# EAGLE design ft2232h-breakout-with-ground-planesch (EAGLE 9.3.0)

## Sheet 1 of 2
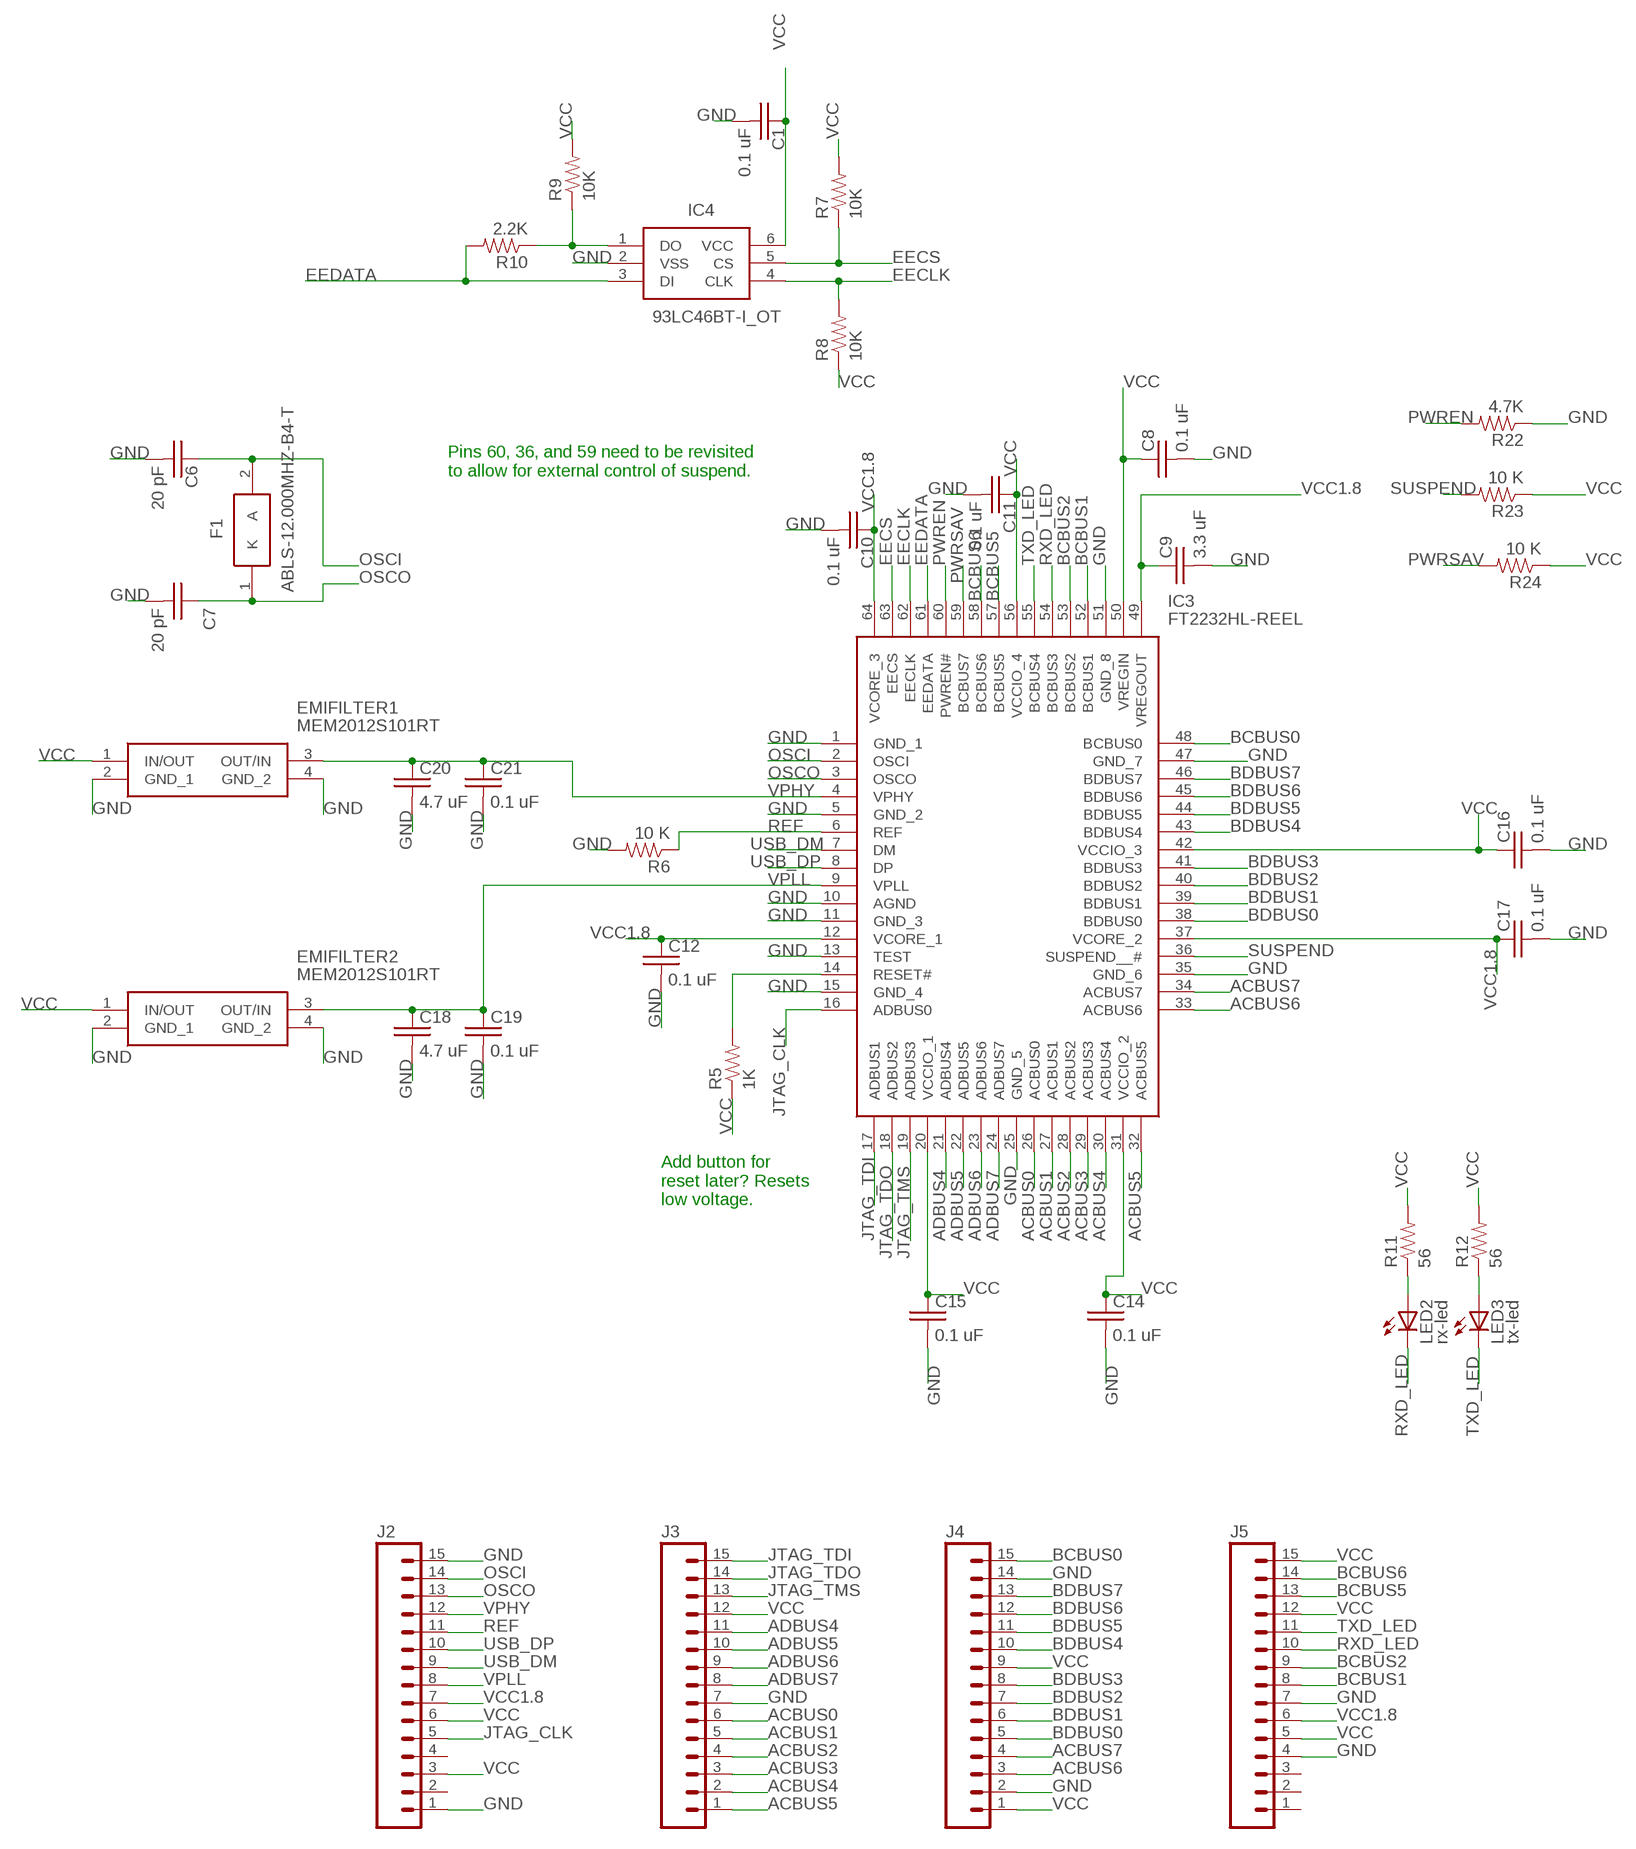
[diagram p0: schematic, sheet 1]

### Parts
C1  0.1 uF  C-USC0805  [C0805]
C6  20 pF  C-USC0805  [C0805]
C7  20 pF  C-USC0805  [C0805]
C8  0.1 uF  C-USC0805  [C0805]
C9  3.3 uF  C-USC0805  [C0805]
C10  0.1 uF  C-USC0805  [C0805]
C11  0.1 uF  C-USC0805  [C0805]
C12  0.1 uF  C-USC0805  [C0805]
C14  0.1 uF  C-USC0805  [C0805]
C15  0.1 uF  C-USC0805  [C0805]
C16  0.1 uF  C-USC0805  [C0805]
C17  0.1 uF  C-USC0805  [C0805]
C18  4.7 uF  C-USC0805  [C0805]
C19  0.1 uF  C-USC0805  [C0805]
C20  4.7 uF  C-USC0805  [C0805]
C21  0.1 uF  C-USC0805  [C0805]
EMIFILTER1  MEM2012S101RT  [MEM2012S101RT]
EMIFILTER2  MEM2012S101RT  [MEM2012S101RT]
F1  ABLS-12.000MHZ-B4-T  [HC/49US-(AT49)_1]
IC3  FT2232HL-REEL  [QFP50P1200X1200X160-64N]
IC4  93LC46BT-I_OT  [SOT95P270X145-6N]
J2  M15  [1X15]
J3  M15  [1X15]
J4  M15  [1X15]
J5  M15  [1X15]
LED2  rx-led  LED3MM  [LED3MM]
LED3  tx-led  LED3MM  [LED3MM]
R5  1K  RESISTOR0805-RES  [0805]
R6  10 K  RESISTOR0805-RES  [0805]
R7  10K  RESISTOR0805-RES  [0805]
R8  10K  RESISTOR0805-RES  [0805]
R9  10K  RESISTOR0805-RES  [0805]
R10  2.2K  RESISTOR0805-RES  [0805]
R11  56  RESISTOR0805-RES  [0805]
R12  56  RESISTOR0805-RES  [0805]
R22  4.7K  RESISTOR0805-RES  [0805]
R23  10 K  RESISTOR0805-RES  [0805]
R24  10 K  RESISTOR0805-RES  [0805]

### Nets
ACBUS0: IC3.26(ACBUS0) J3.6
ACBUS1: IC3.27(ACBUS1) J3.5
ACBUS2: IC3.28(ACBUS2) J3.4
ACBUS3: IC3.29(ACBUS3) J3.3
ACBUS4: IC3.30(ACBUS4) J3.2
ACBUS5: IC3.32(ACBUS5) J3.1
ACBUS6: IC3.33(ACBUS6) J4.3
ACBUS7: IC3.34(ACBUS7) J4.4
ADBUS4: IC3.21(ADBUS4) J3.11
ADBUS5: IC3.22(ADBUS5) J3.10
ADBUS6: IC3.23(ADBUS6) J3.9
ADBUS7: IC3.24(ADBUS7) J3.8
BCBUS0: IC3.48(BCBUS0) J4.15
BCBUS1: IC3.52(BCBUS1) J5.8
BCBUS2: IC3.53(BCBUS2) J5.9
BCBUS5: IC3.57(BCBUS5) J5.13
BCBUS6: IC3.58(BCBUS6) J5.14
BDBUS0: IC3.38(BDBUS0) J4.5
BDBUS1: IC3.39(BDBUS1) J4.6
BDBUS2: IC3.40(BDBUS2) J4.7
BDBUS3: IC3.41(BDBUS3) J4.8
BDBUS4: IC3.43(BDBUS4) J4.10
BDBUS5: IC3.44(BDBUS5) J4.11
BDBUS6: IC3.45(BDBUS6) J4.12
BDBUS7: IC3.46(BDBUS7) J4.13
EECLK: IC3.62(EECLK) IC4.4(CLK) R8.2
EECS: IC3.63(EECS) IC4.5(CS) R7.1
EEDATA: IC3.61(EEDATA) IC4.3(DI) R10.2
GND: C1.2 C6.2 C7.2 C8.2 C9.2 C10.2 C11.2 C12.2 C14.2 C15.2 C16.2 C17.2 C18.2 C19.2 C20.2 C21.2 EMIFILTER1.2(GND_1) EMIFILTER1.4(GND_2) EMIFILTER2.2(GND_1) EMIFILTER2.4(GND_2) IC3.1(GND_1) IC3.5(GND_2) IC3.10(AGND) IC3.11(GND_3) IC3.13(TEST) IC3.15(GND_4) IC3.25(GND_5) IC3.35(GND_6) IC3.47(GND_7) IC3.51(GND_8) IC4.2(VSS) J2.1 J2.15 J3.7 J4.2 J4.14 J5.4 J5.7 R6.2 R22.1 ; also sheet 2
JTAG_CLK: IC3.16(ADBUS0) J2.5
JTAG_TDI: IC3.17(ADBUS1) J3.15
JTAG_TDO: IC3.18(ADBUS2) J3.14
JTAG_TMS: IC3.19(ADBUS3) J3.13
N$6: IC3.14(RESET#) R5.2
N$8: IC4.1(DO) R9.1 R10.1
N$11: LED2.A R11.1
N$13: LED3.A R12.1
OSCI: C6.1 F1.2(A) IC3.2(OSCI) J2.14
OSCO: C7.1 F1.1(K) IC3.3(OSCO) J2.13
PWREN: IC3.60(PWREN#) R22.2
PWRSAV: IC3.59(BCBUS7) R24.2
REF: IC3.6(REF) J2.11 R6.1
RXD_LED: IC3.54(BCBUS3) J5.10 LED2.K(C)
SUSPEND: IC3.36(SUSPEND__#) R23.2
TXD_LED: IC3.55(BCBUS4) J5.11 LED3.K(C)
USB_DM: IC3.7(DM) J2.9 ; also sheet 2
USB_DP: IC3.8(DP) J2.10 ; also sheet 2
VCC [pwr]: C1.1 C8.1 C11.1 C14.1 C15.1 C16.1 EMIFILTER1.1(IN/OUT) EMIFILTER2.1(IN/OUT) IC3.20(VCCIO_1) IC3.31(VCCIO_2) IC3.42(VCCIO_3) IC3.50(VREGIN) IC3.56(VCCIO_4) IC4.6(VCC) J2.3 J2.6 J3.12 J4.1 J4.9 J5.5 J5.12 J5.15 R5.1 R7.2 R8.1 R9.2 R11.2 R12.2 R23.1 R24.1 ; also sheet 2
VCC1.8 [pwr]: C9.1 C10.1 C12.1 C17.1 IC3.12(VCORE_1) IC3.37(VCORE_2) IC3.49(VREGOUT) IC3.64(VCORE_3) J2.7 J5.6
VPHY: C20.1 C21.1 EMIFILTER1.3(OUT/IN) IC3.4(VPHY) J2.12
VPLL: C18.1 C19.1 EMIFILTER2.3(OUT/IN) IC3.9(VPLL) J2.8
Unconnected: J2.2 J2.4 J5.1 J5.2 J5.3

### Notes on the sheet
- Pins 60, 36, and 59 need to be revisited 
  to allow for external control of suspend.
- Add button for 
  reset later? Resets
  low voltage.

## Sheet 2 of 2
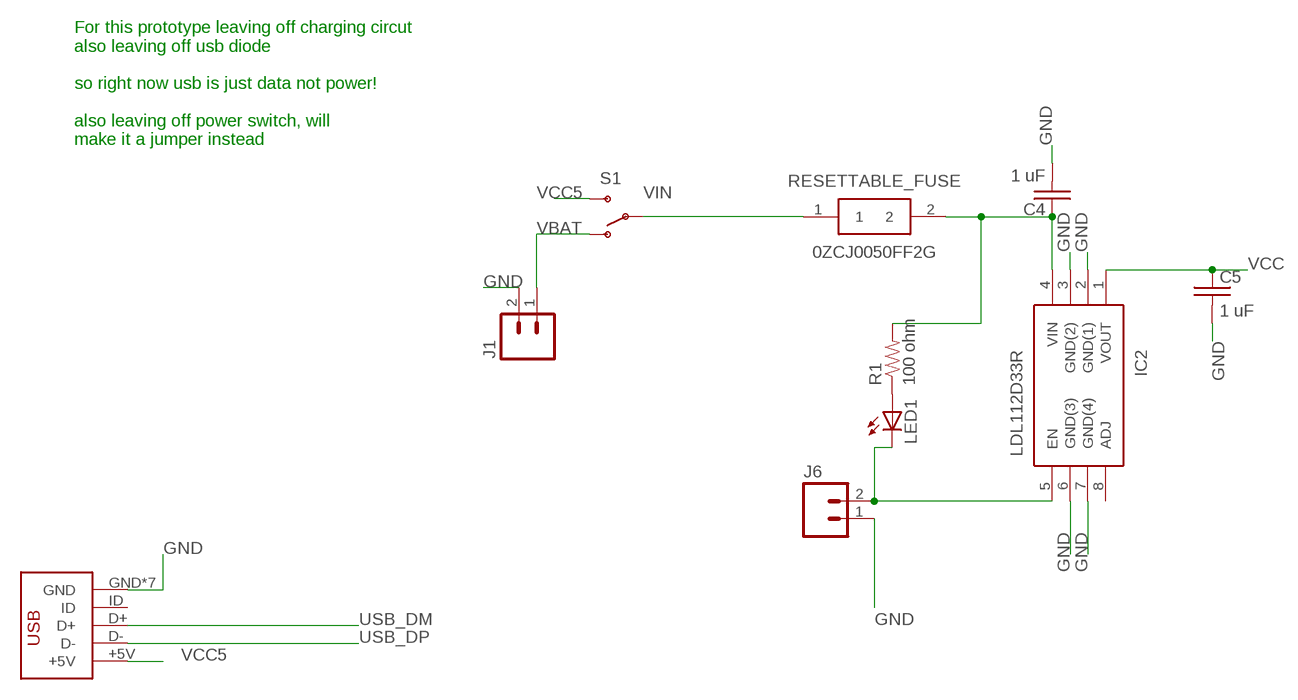
[diagram p1: schematic, sheet 2]

### Parts
C4  1 uF  C-USC0805  [C0805]
C5  1 uF  C-USC0805  [C0805]
IC2  LDL112D33R  [SOIC127P600X175-8N]
J1  M02PTH  [1X02]
J6  M02PTH  [1X02]
LED1  LED3MM  [LED3MM]
R1  100 ohm  RESISTORKIT  [AXIAL-0.3-KIT]
RESETTABLE_FUSE  0ZCJ0050FF2G  [FUSC3216X55N]
S1  SWITCH-SPSTPTH  [SWITCH-SPDT]
U$2  DX4R005JJ2DX4R005JJ2  [DX4R005JJ2]

### Nets
GND: C4.2 C5.2 IC2.2(GND(1)) IC2.3(GND(2)) IC2.6(GND(3)) IC2.7(GND(4)) J1.2 J6.1 U$2.GND U$2.P$6(GND) U$2.P$7(GND) U$2.P$8(GND) U$2.P$9(GND) U$2.P$10(GND) U$2.P$11(GND) ; also sheet 1
N$1: LED1.A R1.P$1
N$2: C4.1 IC2.4(VIN) R1.P$2 RESETTABLE_FUSE.2
N$12: IC2.5(EN) J6.2 LED1.K(C)
USB_DM: U$2.D+ ; also sheet 1
USB_DP: U$2.D- ; also sheet 1
VBAT: J1.1 S1.1(O)
VCC [pwr]: C5.1 IC2.1(VOUT) ; also sheet 1
VCC5 [outside-pwr]: S1.3(S) U$2.+5V
VIN: RESETTABLE_FUSE.1 S1.2(P)
Unconnected: IC2.8(ADJ) U$2.ID

### Notes on the sheet
- For this prototype leaving off charging circut
  also leaving off usb diode
  
  so right now usb is just data not power!
  
  also leaving off power switch, will 
  make it a jumper instead

## Library data of the parts
C1 C4-C12 C14-C21 = passives:C-US: CAPACITOR, American symbol
EMIFILTER1 EMIFILTER2 = passives:MEM2012S101RT: EMI Filter Circuits Source: Datasheet <https://componentsearchengine.com/Datasheets/1/MEM2012S101RT.pdf>; DESCRIPTION: EMI Filter Circuits; HEIGHT: 1mm; MANUFACTURER_NAME: TDK; MANUFACTURER_PART_NUMBER: MEM2012S101RT; MOUSER_PART_NUMBER: N/A
F1 = crystals-timing:ABLS-12.000MHZ-B4-T: ABRACON - ABLS-12.000MHZ-B4-T - CRYSTAL, 12MHZ, 18PF, HC-49US Source: Datasheet <https://componentsearchengine.com/Datasheets/2/ABLS-12.000MHZ-B4-T.pdf>; DESCRIPTION: ABRACON - ABLS-12.000MHZ-B4-T - CRYSTAL, 12MHZ, 18PF, HC-49US; HEIGHT: mm; MANUFACTURER_NAME: ABRACON; MANUFACTURER_PART_NUMBER: ABLS-12.000MHZ-B4-T; MOUSER_PART_NUMBER: 815-ABLS-12.0M-T; MOUSER_PRICE-STOCK: https://www.mouser.com/Search/Refine.aspx?Keyword=815-ABLS-12.0M-T; RS_PART_NUMBER: 1710207; RS_PRICE-STOCK: http://uk.rs-online.com/web/p/products/1710207
IC2 = voltage-regulator:LDL112D33R: LDO Voltage Regulators 1.2 A low quiescent current LDO with reverse current protection Source: Datasheet <https://www.arrow.com/en/products/ldl112d33r/stmicroelectronics>; ARROW_PART_NUMBER: LDL112D33R; ARROW_PRICE/STOCK: https://www.arrow.com/en/products/ldl112d33r/stmicroelectronics; DESCRIPTION: LDO Voltage Regulators 1.2 A low quiescent current LDO with reverse current protection; HEIGHT: 1.75mm; MANUFACTURER_NAME: STMicroelectronics; MANUFACTURER_PART_NUMBER: LDL112D33R
IC3 = ICs:FT2232HL-REEL: FTDI Chip FT2232HL-REEL, USB Controller, 4-channel, 480MBps, USB 2.0, 64-Pin LQFP Source: Datasheet <https://componentsearchengine.com/Datasheets/1/FT2232HL-REEL.pdf>; DESCRIPTION: FTDI Chip FT2232HL-REEL, USB Controller, 4-channel, 480MBps, USB 2.0, 64-Pin LQFP; HEIGHT: 1.6mm; MANUFACTURER_NAME: FTDI Chip; MANUFACTURER_PART_NUMBER: FT2232HL-REEL; MOUSER_PART_NUMBER: 895-FT2232HL
IC4 = eeprom:93LC46BT-I_OT: 1K,64 X 16 Serial EE,SOT23 Source: Datasheet <https://componentsearchengine.com/Datasheets/1/93LC46BT-I_OT.pdf>; DESCRIPTION: 1K,64 X 16 Serial EE,SOT23; HEIGHT: 1.45mm; MANUFACTURER_NAME: Microchip; MANUFACTURER_PART_NUMBER: 93LC46BT-I/OT; MOUSER_PART_NUMBER: 579-93LC46BT-I/OT
J1 J6 = connector:M02: Standard 2-pin 0.1" header. Use with - straight break away headers ( PRT-00116) - right angle break away headers (PRT-00553) - swiss pins (PRT-00743) - machine pins (PRT-00117) - female headers (PRT-00115) Molex polarized connector foot print use with: PRT-08233 with associated crimp pins and housings. 2.54_SCREWTERM for use with PRT-10571. 3.5mm Screw Terminal footprints for PRT-08084 5mm Screw Terminal footprints for use with PRT-08432
J2-J5 = connector:M15: Header 15 Standard 15-pin 0.1" header. Use with straight break away headers (SKU : PRT-00116), right angle break away headers (PRT-00553), swiss pins (PRT-00743), machine pins (PRT-00117), and female headers (PRT-00115).
LED1-LED3 = leds:LED: LEDs Standard schematic elements and footprints for 5mm, 3mm, 1206, and 0603 sized LEDs. 5mm - Spark Fun Electronics SKU : COM-00529 (and others)
R1 R5-R12 R22-R24 = passives:RESISTOR: Resistor Basic schematic elements and footprints for 0603, 1206, and PTH resistors.
RESETTABLE_FUSE = passives:0ZCJ0050FF2G: Resettable Fuses - PPTC <https://componentsearchengine.com/Images/9/0ZCJ0050FF2G.jpg> Source: Datasheet <https://www.belfuse.com/resources/CircuitProtection/datasheets/0ZCJ Nov2016.pdf>; DESCRIPTION: Resettable Fuses - PPTC; HEIGHT: 0.55mm; MANUFACTURER_NAME: Bel-Stewart; MANUFACTURER_PART_NUMBER: 0ZCJ0050FF2G; SUPPLIER_NAME: RS
S1 = switches:SWITCH-SPST: SPST Switch Simple slide switch.
U$2 = connector:DX4R005JJ2

## Net classes
1 pwr: width 0.178 mm, drill 0.254 mm, clearance 0.178 mm to class 0
2 outside-pwr: width 0.229 mm

## Board
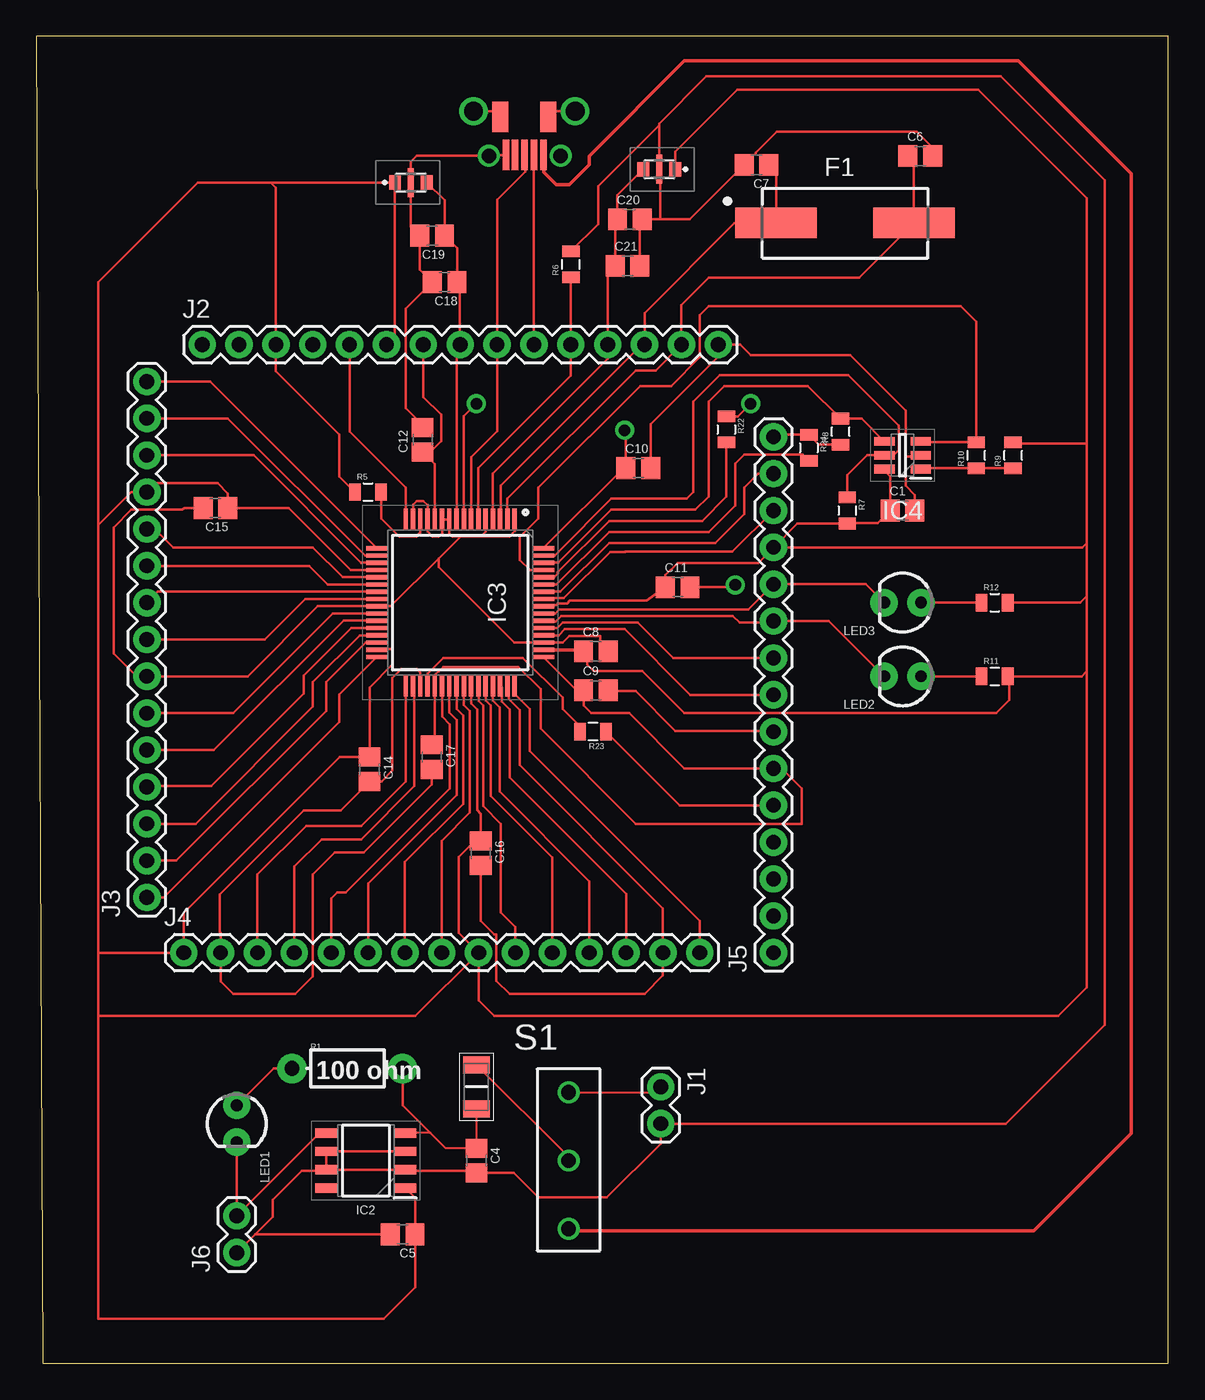
[diagram p2: board, top side]
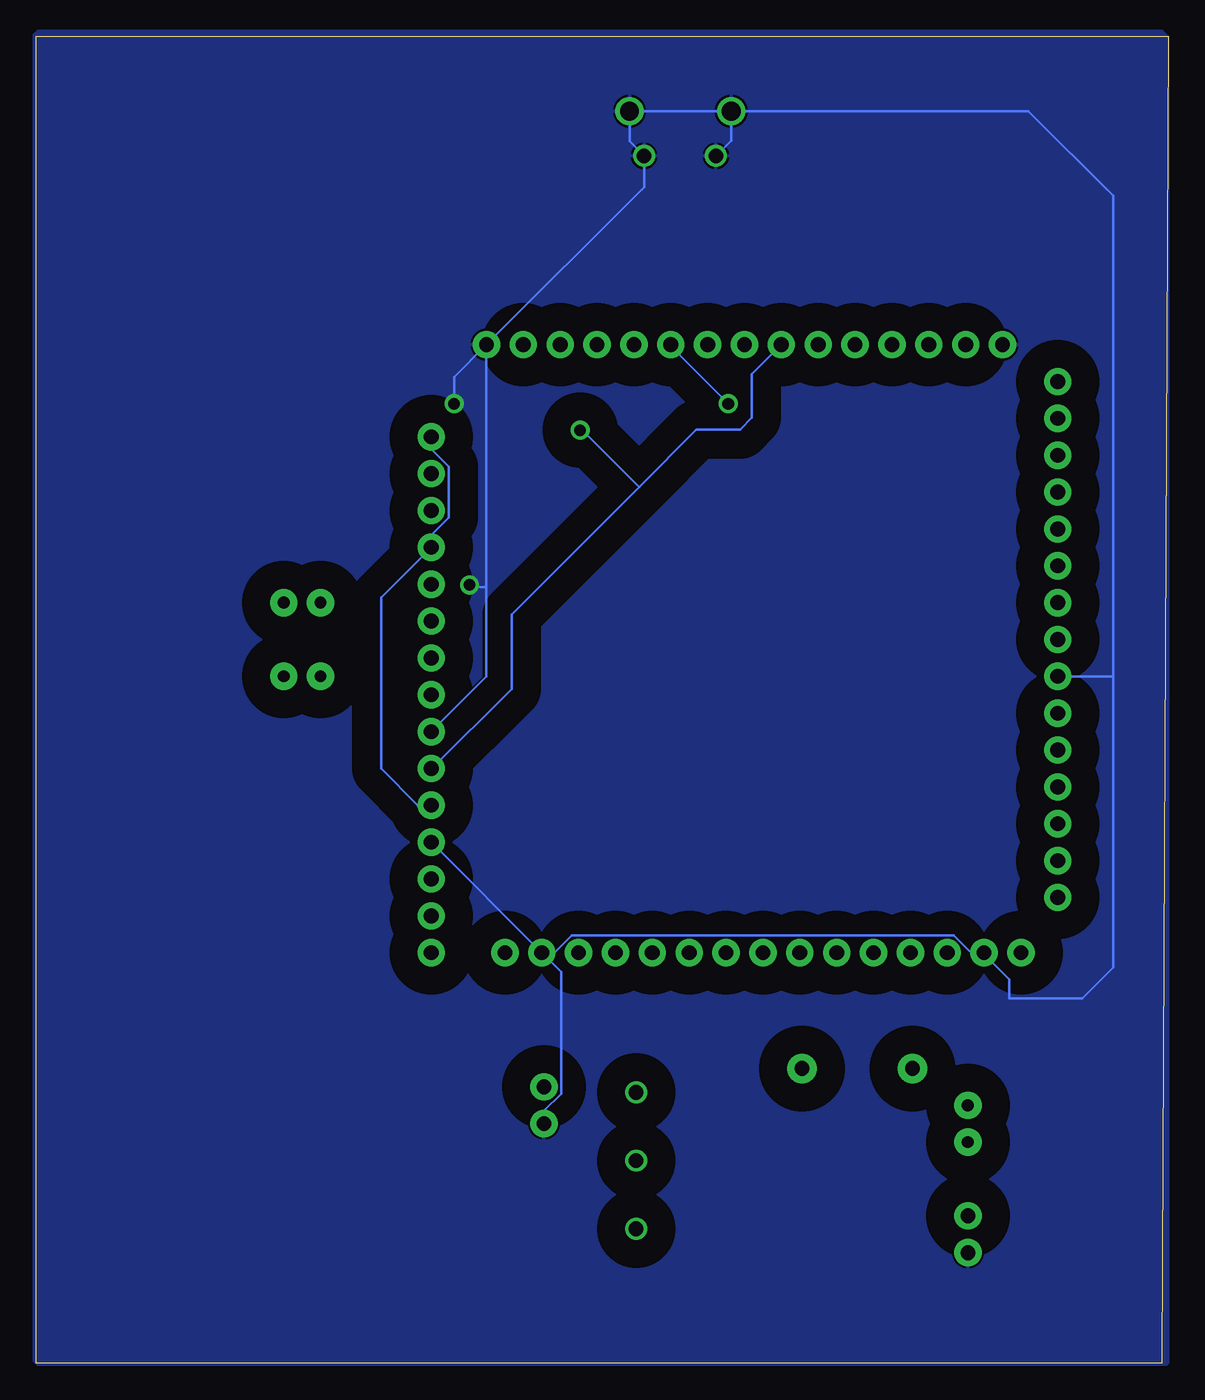
[diagram p3: board, bottom side, seen from below]

Size 78.01 x 91.47 mm. Coordinates in mm from the lower left corner, seen from the top.
Outline: 0.46,0 78.01,0 78.01,91.47 0,91.47 0.46,0
Copper layers (1*16): Top 0.035mm / dielectric 1.5mm / Bottom 0.035mm
Design rules "OthermillDRC_30_deg_v2": minimum track width 6mil, minimum drill 0.8mm, track to track 6mil, track to pad 6mil, pad to pad 6mil, via to via 6mil, smd to smd 0mil, copper to edge 0mil, drill to drill 6mil, minimum pad ring 10mil, minimum via ring 10mil, stop-mask expansion 1mil, vias tented up to drill 30mil, thermal gap 6mil

### Footprints (pad centres in the part's own frame; a part is rotated, then mirrored left to right if it is on the bottom)
C0805 = smd 1.3 x 1.5: 1 -0.85,0; 2 0.85,0
MEM2012S101RT = smd 0.8 x 1: 1 -1.1,0; 3 1.1,0 | smd 0.4 x 1: 2 0,-0.5; 4 0,0.5
HC/49US-(AT49)_1 = smd 5.6 x 2.1: 1 -4.75,0; 2 4.75,0
SOIC127P600X175-8N = smd 1.525 x 0.65: 1 -2.712,1.905; 2 -2.712,0.635; 3 -2.712,-0.635; 4 -2.712,-1.905; 5 2.712,-1.905; 6 2.712,-0.635; 7 2.712,0.635; 8 2.712,1.905
QFP50P1200X1200X160-64N = smd 1.475 x 0.3: 1 -5.738,3.75; 2 -5.738,3.25; 3 -5.738,2.75; 4 -5.738,2.25; 5 -5.738,1.75; 6 -5.738,1.25; 7 -5.738,0.75; 8 -5.738,0.25; 9 -5.738,-0.25; 10 -5.738,-0.75; 11 -5.738,-1.25; 12 -5.738,-1.75; 13 -5.738,-2.25; 14 -5.738,-2.75; 15 -5.738,-3.25; 16 -5.738,-3.75; 33 5.738,-3.75; 34 5.738,-3.25; 35 5.738,-2.75; 36 5.738,-2.25; 37 5.738,-1.75; 38 5.738,-1.25; 39 5.738,-0.75; 40 5.738,-0.25; 41 5.738,0.25; 42 5.738,0.75; 43 5.738,1.25; 44 5.738,1.75; 45 5.738,2.25; 46 5.738,2.75; 47 5.738,3.25; 48 5.738,3.75 | smd 0.3 x 1.475: 17 -3.75,-5.738; 18 -3.25,-5.738; 19 -2.75,-5.738; 20 -2.25,-5.738; 21 -1.75,-5.738; 22 -1.25,-5.738; 23 -0.75,-5.738; 24 -0.25,-5.738; 25 0.25,-5.738; 26 0.75,-5.738; 27 1.25,-5.738; 28 1.75,-5.738; 29 2.25,-5.738; 30 2.75,-5.738; 31 3.25,-5.738; 32 3.75,-5.738; 49 3.75,5.738; 50 3.25,5.738; 51 2.75,5.738; 52 2.25,5.738; 53 1.75,5.738; 54 1.25,5.738; 55 0.75,5.738; 56 0.25,5.738; 57 -0.25,5.738; 58 -0.75,5.738; 59 -1.25,5.738; 60 -1.75,5.738; 61 -2.25,5.738; 62 -2.75,5.738; 63 -3.25,5.738; 64 -3.75,5.738
SOT95P270X145-6N = smd 1.4 x 0.6: 1 -1.25,0.95; 2 -1.25,0; 3 -1.25,-0.95; 4 1.25,-0.95; 5 1.25,0; 6 1.25,0.95
1X02 = drill 1.016 pad 1.88: 1 0,0; 2 2.54,0
1X15 = drill 1.016 pad 1.88: 1 0,0; 2 2.54,0; 3 5.08,0; 4 7.62,0; 5 10.16,0; 6 12.7,0; 7 15.24,0; 8 17.78,0; 9 20.32,0; 10 22.86,0; 11 25.4,0; 12 27.94,0; 13 30.48,0; 14 33.02,0; 15 35.56,0
LED3MM = drill 0.813 pad 1.88: A -1.27,0; K 1.27,0
AXIAL-0.3-KIT = drill 1.016 pad 2.032: P$1 -3.81,0; P$2 3.81,0
0805 = smd 0.8 x 1.2: 1 -0.9,0; 2 0.9,0
FUSC3216X55N = smd 1.17 x 1.82: 1 -1.52,0; 2 1.52,0
SWITCH-SPDT = drill 1.016 pad 1.27: 1 0,4.7; 3 0,-4.7 | drill 1 pad 1.27: 2 0,0
DX4R005JJ2 = smd 2.1 x 0.45: +5V 0.72,-1.32; D+ 0.72,-0.02; D- 0.72,-0.67; GND 0.72,1.28; ID 0.72,0.63 | smd 2.1 x 1.1: P$6 3.35,1.65; P$8 3.35,-1.65 | drill 1: P$7 0.675,2.45; P$9 0.675,-2.5 | drill 1.3: P$10 3.75,-3.5; P$11 3.75,3.5

### Placement (x,y rotation side)
C1  59.69,58.78 0 top
C4  30.33,13.97 270 top
C5  25.25,8.89 180 top
C6  60.91,83.21 0 top
C7  49.63,82.6 180 top
C8  38.56,49.07 0 top
C9  38.56,46.38 0 top
C10  41.48,61.7 0 top
C11  44.2,53.49 0 top
C12  26.62,63.65 90 top
C14  22.96,40.94 270 top
C15  12.34,58.95 180 top
C16  30.63,35.15 270 top
C17  27.25,41.78 270 top
C18  28.14,74.52 180 top
C19  27.28,77.72 180 top
C20  40.89,78.84 0 top
C21  40.74,75.64 0 top
EMIFILTER1  42.93,82.3 180 top
EMIFILTER2  25.81,81.38 0 top
F1  55.73,78.59 0 top
IC2  22.71,13.97 180 top
IC3  29.21,52.43 270 top
IC4  59.69,62.59 180 top
J1  43.03,19.05 270 top
J2  11.43,70.21 0 top
J3  7.62,32.11 90 top
J4  10.16,28.3 0 top
J5  50.8,28.3 90 top
J6  13.82,7.62 90 top
LED1  13.82,16.51 270 top
LED2  59.69,47.35 180 top
LED3  59.69,52.43 180 top
R1  21.44,20.32 0 top
R5  22.86,60.05 0 top
R6  36.83,75.74 90 top
R7  55.88,58.78 270 top
R8  55.42,64.21 90 top
R9  67.31,62.59 90 top
R10  64.77,62.59 90 top
R11  66.04,47.35 0 top
R12  66.04,52.43 0 top
R22  47.55,64.36 270 top
R23  38.35,43.54 180 top
R24  53.24,63.09 270 top
RESETTABLE_FUSE  30.33,19.05 270 top
S1  36.68,13.97 0 top
U$2  33.63,82.55 90 top

### Tracks (layer width: path | path; a pad name or v marks a point on that pad's centre or on a via)
ACBUS0
  Top 0.178: IC3.26 20.43,51.68 13.56,44.81 J3.6
ACBUS1
  Top 0.178: IC3.27 23.44,51.21 21.18,51.21 12.24,42.27 J3.5
ACBUS2
  Top 0.178: J3.4 7.67,39.78 12.04,39.78 18.44,46.18 18.44,47.4 21.72,50.68 IC3.28
ACBUS3
  Top 0.178: IC3.29 22.29,50.18 19.05,46.94 19.05,45.26 10.97,37.19 J3.3
ACBUS4
  Top 0.178: IC3.30 22.7,49.68 19.96,46.94 19.96,44.96 9.65,34.65 J3.2
ACBUS5
  Top 0.178: IC3.32 20.88,46.08 20.88,44.2 8.79,32.11 J3.1
ACBUS6
  Top 0.178: IC3.33 25.46,40.09 22.4,37.03 18.59,37.03 15.24,33.68 J4.3
ACBUS7
  Top 0.178: J4.4 17.78,34.24 19.66,36.12 22.4,36.12 26.06,39.78 26.06,46.59 IC3.34
ADBUS4
  Top 0.178: J3.11 8.18,57.51 9.45,56.24 19.05,56.24 21.11,54.18 IC3.21
ADBUS5
  Top 0.178: IC3.22 20.09,53.68 18.8,54.97 J3.10
ADBUS6
  Top 0.178: IC3.23 10.53,53.18 10.52,53.19 8.38,53.19 J3.9
ADBUS7
  Top 0.178: IC3.24 18.54,52.68 15.75,49.89 J3.8
BCBUS0
  Top 0.178: IC3.48 32.96,46.14 33.98,45.11 33.98,42.21 45.72,30.48 J4.15
BCBUS1
  Top 0.178: IC3.52 36,50.18 36.42,50.6 40.54,50.6 45.06,46.08 J5.8
BCBUS2
  Top 0.178: IC3.53 35.89,50.68 36.27,51.05 41.45,51.05 43.89,48.62 J5.9
BCBUS5
  Top 0.178: IC3.57 35,52.73 36.35,52.73 39.55,55.93 40.58,55.93 47.95,55.93 J5.13
BCBUS6
  Top 0.178: IC3.58 34.96,53.19 36.12,53.19 39.47,56.54 46.79,56.54 48.77,58.52 48.77,60.35 49.73,61.32 J5.14
BDBUS0
  Top 0.178: IC3.38 27.96,44.58 28.5,44.04 28.5,39.62 21.34,32.46 20.73,32.46 20.32,32.05 J4.5
BDBUS1
  Top 0.178: IC3.39 28.46,44.84 28.96,44.35 28.96,39.17 22.86,33.07 J4.6
BDBUS2
  Top 0.178: IC3.40 28.96,45.11 29.41,44.65 29.41,38.56 25.4,34.54 J4.7
BDBUS3
  Top 0.178: IC3.41 29.46,45.37 29.87,44.96 29.87,37.95 27.94,36.02 J4.8
BDBUS4
  Top 0.178: IC3.43 30.48,46.67 30.48,45.64 30.79,45.34 30.79,38.4 32,37.19 32,31.09 33.02,30.07 J4.10
BDBUS5
  Top 0.178: IC3.44 30.96,45.7 31.32,45.34 31.32,39.09 35.56,34.85 J4.11
BDBUS6
  Top 0.178: IC3.45 31.46,45.66 31.93,45.2 31.93,39.4 38.1,33.22 J4.12
BDBUS7
  Top 0.178: IC3.46 32.07,46.58 32.07,45.62 32.61,45.08 32.61,40.39 40.64,32.36 J4.13
EECLK
  Top 0.178: IC3.62 35.97,55.18 39.62,58.83 45.41,58.83 46.33,59.74 46.33,66.29 47.4,67.36 53.17,67.36 R8.2 56.86,65.11 IC4.4
EECS
  Top 0.178: R7.1 55.88,61.21 57.25,62.59 IC4.5 59.08,62.59 59.44,62.94 59.44,64.62 55.93,68.12 47.09,68.12 45.26,66.29 45.26,60.05 44.81,59.59 39.62,59.59 35.95,55.92 35.71,55.68 IC3.63
EEDATA
  Top 0.178: IC4.3 60.99,63.49 R10.2 64.77,71.78 63.7,72.85 46.33,72.85 45.72,72.24 45.72,69.34 43.74,67.36 41.6,67.36 34.59,60.35 34.59,58.22 33.32,56.94 33.32,55.38 34.02,54.68 IC3.61
GND  (via drill 0.8)
  Top 0.178: IC2.3 IC2.6 IC2.7 | IC2.7 IC2.2 25.5,13.26 30.19,13.26 C4.2 32.91,13.12 34.59,11.43 39.32,11.43 43.03,15.14 J1.2 66.8,16.51 73.61,23.32 73.61,81.53 66.45,88.7 46.18,88.7 42.93,85.45 42.93,85.34 | IC2.7 19.92,13.26 18.29,13.26 16.31,11.28 16.31,10.11 15.09,8.89 | 15.09,8.89 J6.1 | C5.2 15.09,8.89 | IC3.15 25.96,59.18 26.21,59.44 26.67,59.44 26.96,59.15 IC3.13 26.96,57.32 27.28,57 27.74,57 27.96,57.22 IC3.11 IC3.10 28.46,57.19 28.65,57 29.26,57 | 29.26,57 30.63,57 | 30.63,57 30.96,57.33 IC3.5 | 27.74,55.47 24.44,52.18 IC3.25 19.41,52.18 14.58,47.35 J3.7 6.91,47.35 5.33,48.92 5.33,57.61 6.55,58.83 10.06,58.83 10.19,58.95 C15.2 | 27.74,55.47 29.26,57 | IC3.35 26.46,47.61 26.21,47.85 25.15,47.85 24.54,47.24 24.54,40.84 23.79,40.09 C14.2 20.97,38.1 18.44,38.1 12.65,32.31 12.65,29.72 12.7,29.67 J4.2 12.7,26.31 13.56,25.45 17.83,25.45 19.05,26.67 19.05,33.68 20.57,35.2 22.55,35.2 27.25,39.9 C17.2 | C8.2 38.86,49.62 38.86,50.14 36.73,50.14 36.26,49.68 IC3.51 32.92,49.68 27.74,54.86 27.74,55.47 | IC3.1 32.96,57.34 32.61,57 30.63,57 | C16.2 30.63,30.48 31.55,29.57 31.7,29.57 31.7,26.37 32.61,25.45 41.91,25.45 43.18,26.72 J4.14 43.18,31.34 33.3,41.22 33.3,45.04 32.57,45.77 32.57,46.58 IC3.47 | C10.2 42.33,64.73 46.99,69.39 J2.15 48.51,70.21 49.23,69.49 56.08,69.49 59.92,65.66 59.92,62.51 59.89,62.48 | C21.2 41.59,78.69 C20.2 42.98,78.84 | R6.2 38.71,78.52 38.71,81.13 42.93,85.34 | U$2.P$8 35.68,86.3 U$2.P$10 | U$2.P$6 31.58,86.3 U$2.P$11 | U$2.GND 31.23,83.27 U$2.P$7 26.23,83.22 25.81,82.8 EMIFILTER2.4 EMIFILTER2.2 25.81,78.35 C19.2 26.43,75.39 C18.2 25.45,72.68 25.45,65.84 26.62,64.67 C12.2
  Top 0.178: 42.98,78.84 45.02,78.84 C7.2 49.59,83.41 49.59,83.45 51.03,84.89 60.66,84.89 61.76,83.78 C6.2 | 59.89,62.48 59.89,60.5 60.54,59.86 C1.2 | R22.1 48.35,65.26 v49.23,66.14 | IC4.2 60.84,62.48 59.89,62.48 | C11.2 48.01,53.49 v48.16,53.64 | 42.98,78.84 42.98,81.75 EMIFILTER1.4 EMIFILTER1.2 42.93,85.34 | C9.2 39.46,46.33 41.3,46.33 44.04,43.59 50.75,43.59 J5.7
  Bottom 0.178: U$2.P$7 30.13,84.27 U$2.P$11 | U$2.P$11 U$2.P$10 37.13,84.22 U$2.P$9 36.13,81.07 J2.15 | J2.15 46.99,53.49 | J4.2 12.8,28.3 | 12.8,28.3 13.57,28.3 14.78,29.5 41.1,29.5 42.31,28.3 J4.14 | J1.2 43.03,17.38 41.85,18.56 41.85,26.96 J4.14 | v49.23,66.14 49.23,67.97 J2.15 | 46.99,53.49 48.01,53.49 v48.16,53.64 | J5.7 46.99,47.35 46.99,53.49 | J4.14 J5.4 | U$2.P$11 9.64,86.3 3.81,80.47 3.81,47.4 | 12.8,28.3 10.97,26.47 10.97,25.15 5.94,25.15 3.81,27.28 3.81,47.4 | J3.7 3.86,47.35 3.81,47.4
  pour Bottom (isolate 1.93): 0,91.44 0,0 0.15,-0.15 77.88,-0.15 78.18,0.15 78.18,91.59 77.88,91.9 0.46,91.9
JTAG_CLK
  Top 0.178: IC3.16 25.46,60.34 21.59,64.21 J2.5
JTAG_TDI
  Top 0.178: IC3.17 11.98,67.67 J3.15
JTAG_TDO
  Top 0.178: J3.14 13.21,65.13 22.66,55.68 IC3.18
JTAG_TMS
  Top 0.178: IC3.19 22.41,55.18 22.4,55.17 14.99,62.59 J3.13
N$1
  Top 0.178: R1.P$1 16.36,20.32 LED1.A
N$2
  Top 0.152: RESETTABLE_FUSE.2 C4.1 28.21,14.82 27.15,15.87 IC2.4
  Top 0.178: 27.15,15.87 25.25,17.78 R1.P$2
N$6
  Top 0.178: IC3.14 26.46,57.24 26.21,57 24.99,57 23.76,58.23 R5.2
N$8
  Top 0.178: R9.1 R10.1 60.99,61.69 IC4.1
N$11
  Top 0.178: LED2.A R11.1
N$12
  Top 0.178: LED1.K J6.2 19.53,15.87 IC2.5
N$13
  Top 0.178: LED3.A R12.1
OSCI
  Top 0.178: C6.1 60.48,82.79 F1.2 56.72,74.83 46.33,74.83 44.45,72.95 J2.14 42.67,68.43 41.3,68.43 32.46,59.59 IC3.2
OSCO
  Top 0.178: C7.1 50.98,82.1 F1.1 48.11,78.59 41.91,72.39 J2.13 41.71,70.21 32,60.5 32,58.21 IC3.3
PWREN
  Top 0.178: IC3.60 35.68,54.18 35.93,54.43 35.93,54.52 39.47,58.06 45.87,58.06 47.55,59.74 R22.2
PWRSAV
  Top 0.178: IC3.59 35.84,53.68 39.47,57.3 46.33,57.3 48.16,59.13 48.16,62.03 48.77,62.64 52.8,62.64 R24.2
REF
  Top 0.178: R6.1 36.83,70.26 J2.11 36.83,68.07 30.46,61.7 IC3.6
RXD_LED
  Top 0.178: IC3.54 34.99,51.13 35.78,51.13 36.16,51.51 48.01,51.51 48.46,51.05 50.7,51.05 J5.10 54.61,51.16 LED2.K
SUSPEND
  Top 0.178: IC3.36 26.98,46.7 26.98,47.55 28.04,48.62 33.53,48.62 36.27,45.87 36.27,45.11 37.45,43.93 R23.2
TXD_LED
  Top 0.178: IC3.55 35.75,51.68 36.04,51.97 49.07,51.97 J5.11 57.15,53.7 LED3.K
USB_DM
  Top 0.178: U$2.D+ 33.68,83.24 33.68,82.14 31.75,80.21 J2.9 31.75,64.26 29.96,62.47 IC3.7
USB_DP  (via drill 0.8)
  Top 0.178: J2.10 U$2.D- | IC3.8 29.46,65.27 v30.33,66.14
  Bottom 0.178: v30.33,66.14 34.29,70.1 J2.10
VBAT
  Top 0.152: S1.1 42.65,18.67 J1.1
VCC
  Top 0.178: IC2.1 26.1,11.39 C5.1 26.1,5.22 23.93,3.05 4.27,3.05 4.27,23.93 | 4.27,23.93 4.27,28.19 | 4.27,28.19 4.27,57.76 | 4.27,57.76 6.55,60.05 J3.12 8.23,60.66 12.5,60.66 13.19,59.96 C15.1 17.4,58.95 21.68,54.68 IC3.20 | J4.9 26.11,23.93 4.27,23.93 | J4.9 30.48,24.99 31.55,23.93 70.41,23.93 72.39,25.91 72.39,47.7 | 72.39,63.4 72.39,80.31 64.92,87.78 48.31,87.78 44.03,83.5 EMIFILTER1.1 | 72.39,63.4 72.39,56.54 | 72.39,56.54 72.39,52.88 | 72.39,52.88 72.39,47.7 | 4.27,57.76 4.27,74.52 11.12,81.38 16.15,81.38 | 16.15,81.38 EMIFILTER2.1 24.71,70.78 J2.6 | 16.15,81.38 16.51,81.03 J2.3 16.51,68.38 20.88,64.01 20.88,61.13 R5.1 | IC3.31 23.52,49.23 24.54,49.23 24.54,48.16 22.96,46.58 C14.1 20.92,41.79 10.16,31.04 J4.1 4.37,28.3 4.27,28.19 | IC3.42 29.96,45.48 30.38,45.06 30.38,38.13 30.63,37.87 C16.1 30.21,36 29.11,34.9 29.11,29.67 J4.9 | J5.12 49.73,55.17 44.2,55.17 43.35,54.32 C11.1 42.06,52.58 36.77,52.58 36.57,52.37 35.95,52.37 35.83,52.26 35.03,52.26 IC3.56 | IC4.6 58.37,61.57 58.84,61.1 C1.1 57.98,57.91 55.92,57.91 R7.2 52.44,57.88 J5.12 | R9.2 67.4,63.4 72.39,63.4 | J5.12 72.08,56.24 72.39,56.54 | R12.2 71.93,52.43 72.39,52.88 | R11.2 67.06,47.35 | 67.06,47.35 72.03,47.35 72.39,47.7 | J5.15 50.94,63.99 R24.1 53.92,63.31 R8.1 | C8.1 37.95,48.83 37.95,48.16 38.41,47.7 41.76,47.7 44.65,44.81 66.14,44.81 67.06,45.72 67.06,47.35 | J5.5 44.33,38.46 R23.1
  Top 0.229: IC3.50 37.6,49.18 C8.1
  Bottom 0.178: J5.15 50.8,63.02 49.59,61.82 49.59,58.28 50.8,57.07 J5.12 54.25,52.78 54.25,41 51.71,38.46 J5.5
VCC1.8  (via drill 0.8)
  Top 0.178: IC3.12 27.46,61.96 26.65,62.77 | 26.65,62.77 C12.1 | C17.1 27.46,42.84 IC3.37 27.46,47.45 27.7,47.69 27.73,47.69 28.04,48.01 33.22,48.01 34.75,46.48 34.75,43.74 41.3,37.19 52.73,37.19 52.73,39.62 51.36,41 J5.6 44.65,41 40.84,44.81 38.25,44.81 37.71,45.35 C9.1 37.24,46.38 IC3.49 | IC3.64 40.47,61.7 C10.1 40.63,64.22 v40.54,64.31 | J2.7 26.67,66.6 27.89,65.38 27.89,63.55 27.11,62.77 26.65,62.77
  Bottom 0.178: J2.7 28.7,68.18 28.7,65.17 29.51,64.36 32.52,64.36 36.47,60.4 | 36.47,60.4 45.26,51.61 45.26,46.48 50.75,41 J5.6 | 36.47,60.4 40.39,64.31 v40.54,64.31
VCC5
  Top 0.229: U$2.+5V 34.95,82.09 35.81,81.23 36.73,81.23 38.1,82.6 38.1,83.21 44.65,89.76 67.67,89.76 75.44,81.99 75.44,15.85 68.73,9.14 36.8,9.14 S1.3
VIN
  Top 0.152: S1.2 36.68,14.22 RESETTABLE_FUSE.1
VPHY
  Top 0.178: EMIFILTER1.3 40.04,80.51 C20.1 39.89,78.69 C21.1 39.37,75.12 J2.12 39.37,69.24 31.46,61.33 IC3.4
VPLL
  Top 0.178: IC3.9 28.96,69.96 29.18,70.18 | 29.18,70.18 J2.8 | EMIFILTER2.3 28.13,80.16 C19.1 28.99,76.86 C18.1 29.18,74.33 29.18,70.18